# EAGLE design graviton-hat (EAGLE 6.6.0)
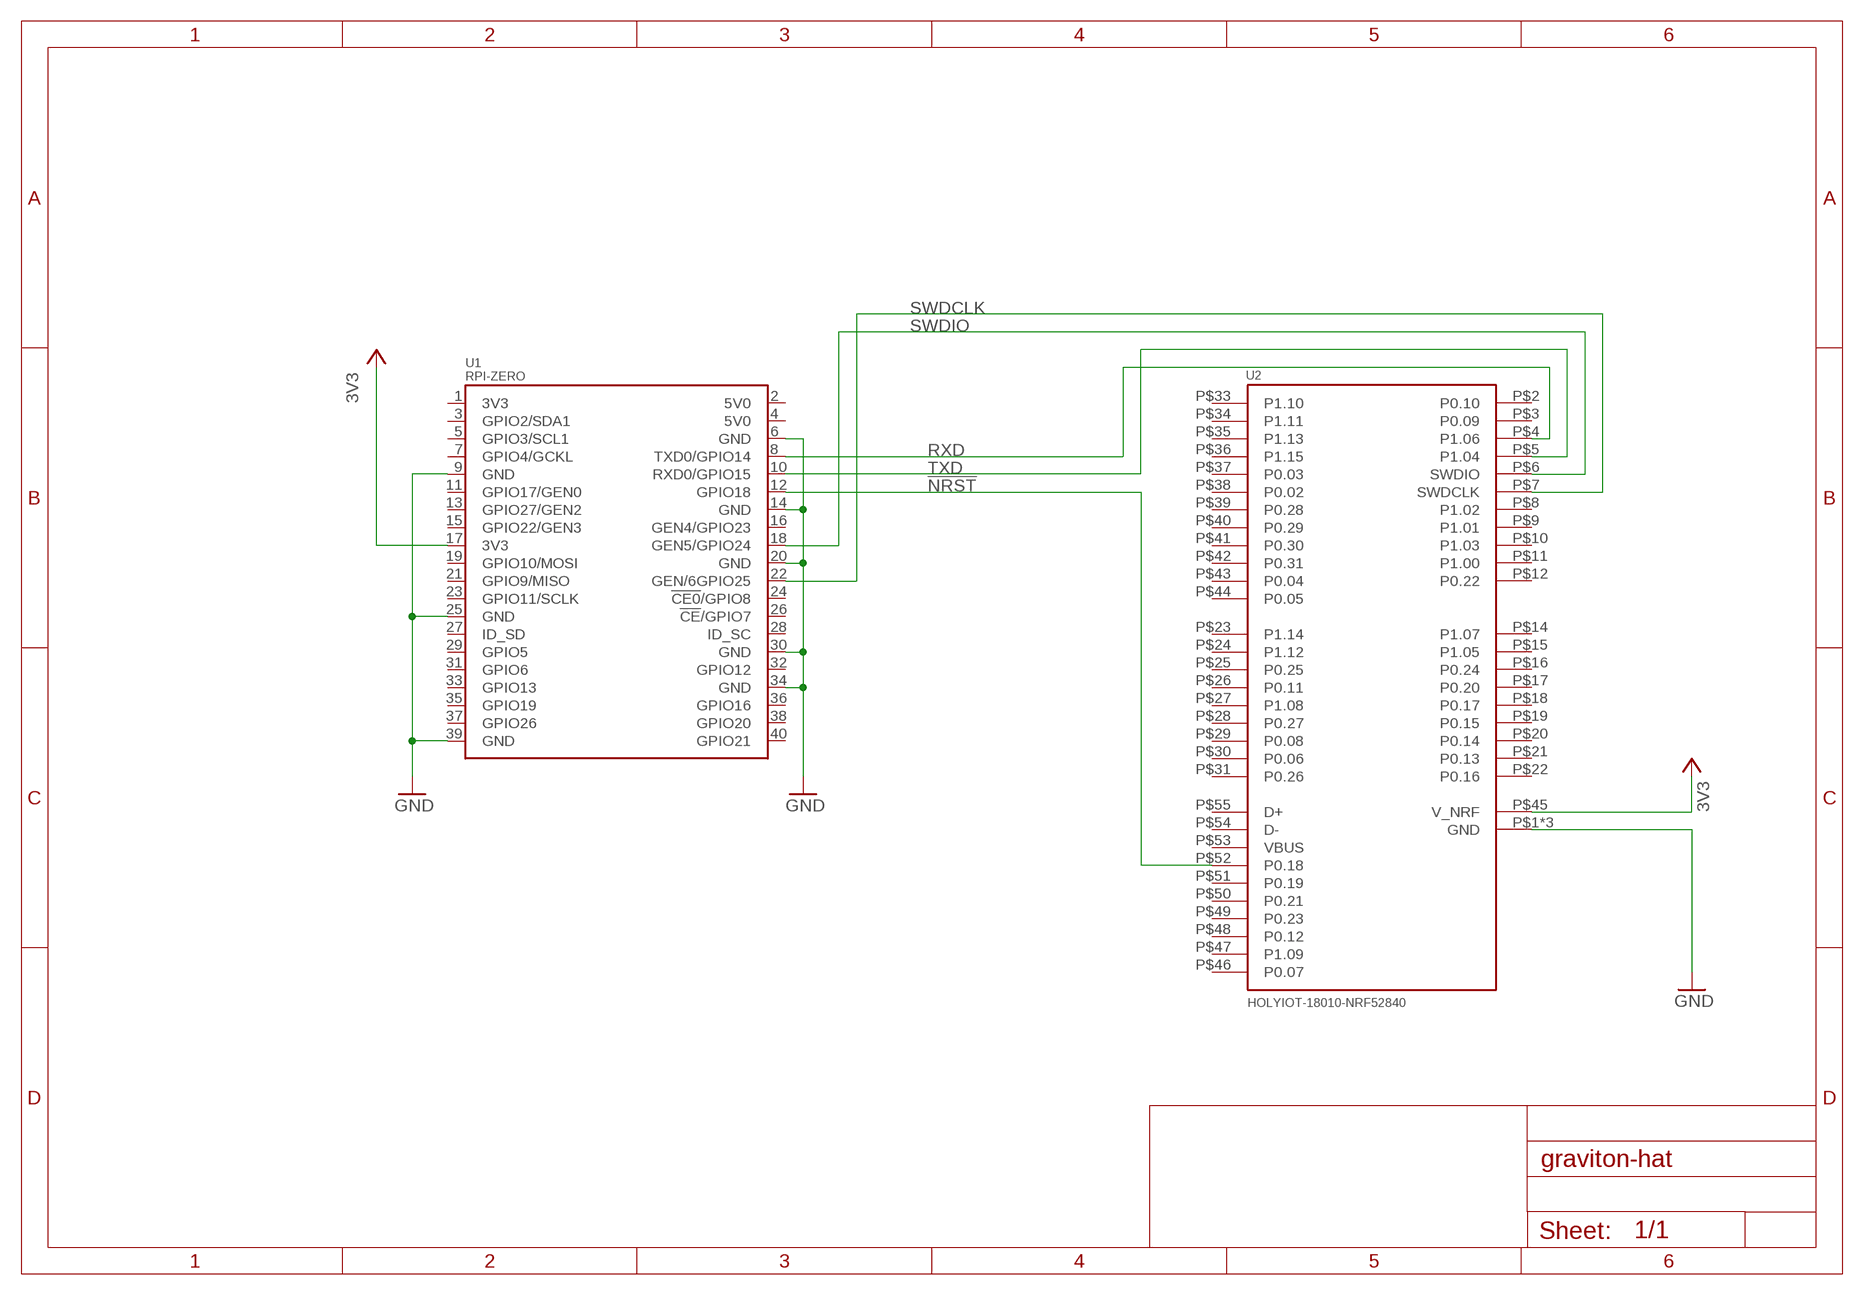
[diagram p0: schematic, sheet 1]

## Parts
U1  RPI-ZERO  [RASP_PI_ZERO_BOARD_FULL]
U2  HOLYIOT-18010-NRF52840  [HOLYIOT-18010-NRF52840]

## Nets
3V3: U1.17(3V3) U2.P$45(V_NRF) ; supply symbol labelled VCC
!NRST: U1.12(GPIO18) U2.P$52(P0.18)
GND: U1.6(GND) U1.9(GND) U1.14(GND) U1.20(GND) U1.25(GND) U1.30(GND) U1.34(GND) U1.39(GND) U2.P$1(GND) U2.P$13(GND) U2.P$32(GND)
RXD: U1.8(TXD0/GPIO14) U2.P$4(P1.06)
SWDCLK: U1.22(GEN/6GPIO25) U2.P$7(SWDCLK)
SWDIO: U1.18(GEN5/GPIO24) U2.P$6(SWDIO)
TXD: U1.10(RXD0/GPIO15) U2.P$5(P1.04)
Unconnected: U1.1(3V3) U1.2(5V0) U1.3(GPIO2/SDA1) U1.4(5V0) U1.5(GPIO3/SCL1) U1.7(GPIO4/GCKL) U1.11(GPIO17/GEN0) U1.13(GPIO27/GEN2) U1.15(GPIO22/GEN3) U1.16(GEN4/GPIO23) U1.19(GPIO10/MOSI) U1.21(GPIO9/MISO) U1.23(GPIO11/SCLK) U1.24(!CE0!/GPIO8) U1.26(!CE!/GPIO7) U1.27(ID_SD) U1.28(ID_SC) U1.29(GPIO5) U1.31(GPIO6) U1.32(GPIO12) U1.33(GPIO13) U1.35(GPIO19) U1.36(GPIO16) U1.37(GPIO26) U1.38(GPIO20) U1.40(GPIO21) U2.P$2(P0.10) U2.P$3(P0.09) U2.P$8(P1.02) U2.P$9(P1.01) U2.P$10(P1.03) U2.P$11(P1.00) U2.P$12(P0.22) U2.P$14(P1.07) U2.P$15(P1.05) U2.P$16(P0.24) U2.P$17(P0.20) U2.P$18(P0.17) U2.P$19(P0.15) U2.P$20(P0.14) U2.P$21(P0.13) U2.P$22(P0.16) U2.P$23(P1.14) U2.P$24(P1.12) U2.P$25(P0.25) U2.P$26(P0.11) U2.P$27(P1.08) U2.P$28(P0.27) U2.P$29(P0.08) U2.P$30(P0.06) U2.P$31(P0.26) U2.P$33(P1.10) U2.P$34(P1.11) U2.P$35(P1.13) U2.P$36(P1.15) U2.P$37(P0.03) U2.P$38(P0.02) U2.P$39(P0.28) U2.P$40(P0.29) U2.P$41(P0.30) U2.P$42(P0.31) U2.P$43(P0.04) U2.P$44(P0.05) U2.P$46(P0.07) U2.P$47(P1.09) U2.P$48(P0.12) U2.P$49(P0.23) U2.P$50(P0.21) U2.P$51(P0.19) U2.P$53(VBUS) U2.P$54(D-) U2.P$55(D+)

## Library data of the parts
U1 = rpi-zero:RPI-ZERO
U2 = rpi-zero:HOLYIOT-18010-NRF52840

## Board
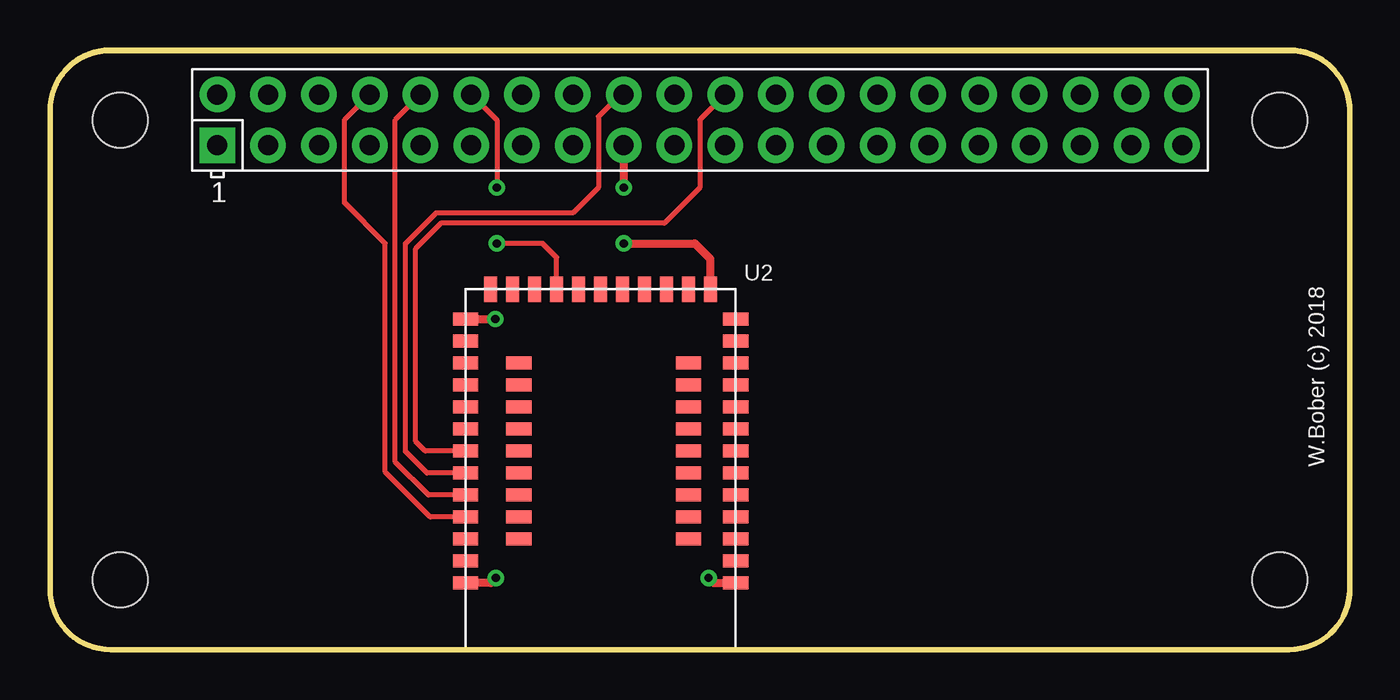
[diagram p1: board, top side]
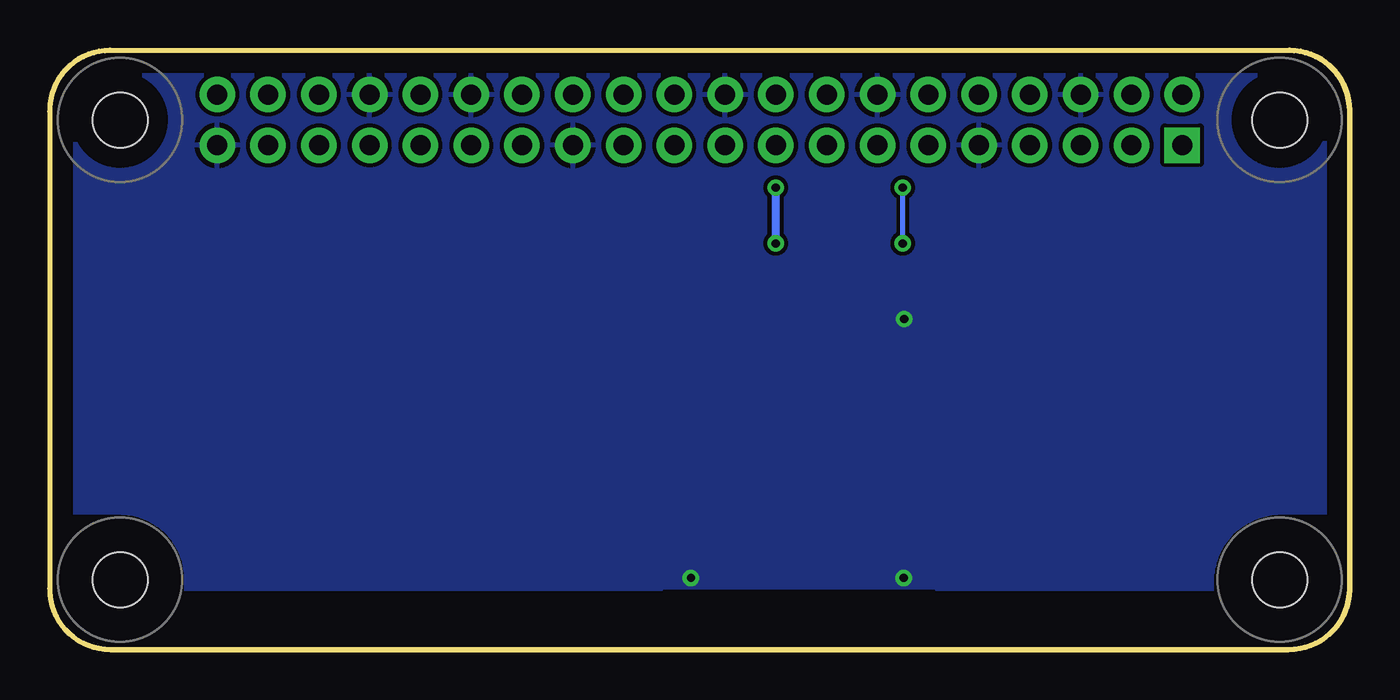
[diagram p2: board, bottom side, seen from below]

Size 65 x 30 mm. Coordinates in mm from the lower left corner, seen from the top.
Copper layers (1*16): Top 0.035mm / dielectric 1.5mm / Bottom 0.035mm
Design rules "default *": minimum track width 10mil, minimum drill 6mil, track to track 8mil, track to pad 8mil, pad to pad 8mil, via to via 8mil, smd to smd 8mil, copper to edge 40mil, drill to drill 8mil, minimum pad ring 10mil, minimum via ring 8mil, stop-mask expansion 4mil, vias tented up to drill 20mil, thermal gap 10mil
bRestrict: 11 lines
Milling: 8 lines

### Footprints (pad centres in the part's own frame; a part is rotated, then mirrored left to right if it is on the bottom)
RASP_PI_ZERO_BOARD_FULL = drill 1 pad 1.778 square: 1 8.37,25.23 | drill 1 pad 1.778: 2 8.37,27.77; 3 10.91,25.23; 4 10.91,27.77; 5 13.45,25.23; 6 13.45,27.77; 7 15.99,25.23; 8 15.99,27.77; 9 18.53,25.23; 10 18.53,27.77; 11 21.07,25.23; 12 21.07,27.77; 13 23.61,25.23; 14 23.61,27.77; 15 26.15,25.23; 16 26.15,27.77; 17 28.69,25.23; 18 28.69,27.77; 19 31.23,25.23; 20 31.23,27.77; 21 33.77,25.23; 22 33.77,27.77; 23 36.31,25.23; 24 36.31,27.77; 25 38.85,25.23; 26 38.85,27.77; 27 41.39,25.23; 28 41.39,27.77; 29 43.93,25.23; 30 43.93,27.77; 31 46.47,25.23; 32 46.47,27.77; 33 49.01,25.23; 34 49.01,27.77; 35 51.55,25.23; 36 51.55,27.77; 37 54.09,25.23; 38 54.09,27.77; 39 56.63,25.23; 40 56.63,27.77 | hole 2.75: 3.5,3.5; 3.5,26.5; 61.5,3.5; 61.5,26.5
HOLYIOT-18010-NRF52840 = smd 1.27 x 0.635: P$1 13.5,14.7; P$2 13.5,13.6; P$3 13.5,12.5; P$4 13.5,11.4; P$5 13.5,10.3; P$6 13.5,9.2; P$7 13.5,8.1; P$8 13.5,7; P$9 13.5,5.9; P$10 13.5,4.8; P$11 13.5,3.7; P$12 13.5,2.6; P$13 13.5,1.5; P$14 10.85,12.5; P$15 10.85,11.4; P$16 10.85,10.3; P$17 10.85,9.2; P$18 10.85,8.1; P$19 10.85,7; P$20 10.85,5.9; P$21 10.85,4.8; P$22 10.85,3.7; P$23 2.35,12.5; P$24 2.35,11.4; P$25 2.35,10.3; P$26 2.35,9.2; P$27 2.35,8.1; P$28 2.35,7; P$29 2.35,5.9; P$30 2.35,4.8; P$31 2.35,3.7; P$32 0,14.7; P$33 0,13.6; P$34 0,12.5; P$35 0,11.4; P$36 0,10.3; P$37 0,9.2; P$38 0,8.1; P$39 0,7; P$40 0,5.9; P$41 0,4.8; P$42 0,3.7; P$43 0,2.6; P$44 0,1.5 | smd 0.635 x 1.27: P$45 1.25,0; P$46 2.35,0; P$47 3.45,0; P$48 4.55,0; P$49 5.65,0; P$50 6.75,0; P$51 7.85,0; P$52 8.95,0; P$53 10.05,0; P$54 11.15,0; P$55 12.25,0

### Placement (x,y rotation side)
U1  0,0 0 top
U2  34.29,18.03 180 top

### Tracks (layer width: path | path; a pad name or v marks a point on that pad's centre or on a via)
3V3  (via drill 0.41)
  Top 0.406: U1.17 28.69,23.13 v28.7,23.11 | v28.7,20.32 32.26,20.32 33.02,19.56 33.02,18.05 U2.P$45
  Bottom 0.406: v28.7,23.11 v28.7,20.32
!NRST  (via drill 0.41)
  Top 0.254: U1.12 22.35,26.49 v22.35,23.11 | U2.P$52 25.34,19.62 24.64,20.32 v22.35,20.32
  Bottom 0.254: v22.35,23.11 v22.35,20.32
GND  (via drill 0.41, 0.41 pad 0.3)
  Top 0.406: U2.P$13 v22.27,16.53 v22.28,16.54 | v22.3,3.58 22.05,3.33 U2.P$1 | v32.94,3.58 33.19,3.33 U2.P$32
  pour Bottom: 5.59,29.97 3.05,29.97 arc90 0,26.92 0,3.05 arc90 3.05,0 61.98,0 arc90 65.02,3.05 65.02,27.18 arc90 62.23,29.97
RXD
  Top 0.254: U1.8 14.73,26.51 14.73,22.35 16.76,20.32 16.76,8.89 19.02,6.63 U2.P$4
SWDCLK
  Top 0.254: U2.P$7 18.77,9.93 18.29,10.41 18.29,20.07 19.56,21.34 30.73,21.34 32.51,23.11 32.51,26.51 U1.22
SWDIO
  Top 0.254: U2.P$6 18.85,8.83 17.78,9.91 17.78,20.32 19.3,21.84 26.16,21.84 27.43,23.11 27.43,26.67 28.53,27.77 U1.18
TXD
  Top 0.254: U1.10 17.27,26.51 17.27,9.4 18.94,7.73 U2.P$5

### Text on the board
tPlace: W.Bober (c) 2018